# Altium schematic sheet 2 - BLE.SchDoc
size Tabloid
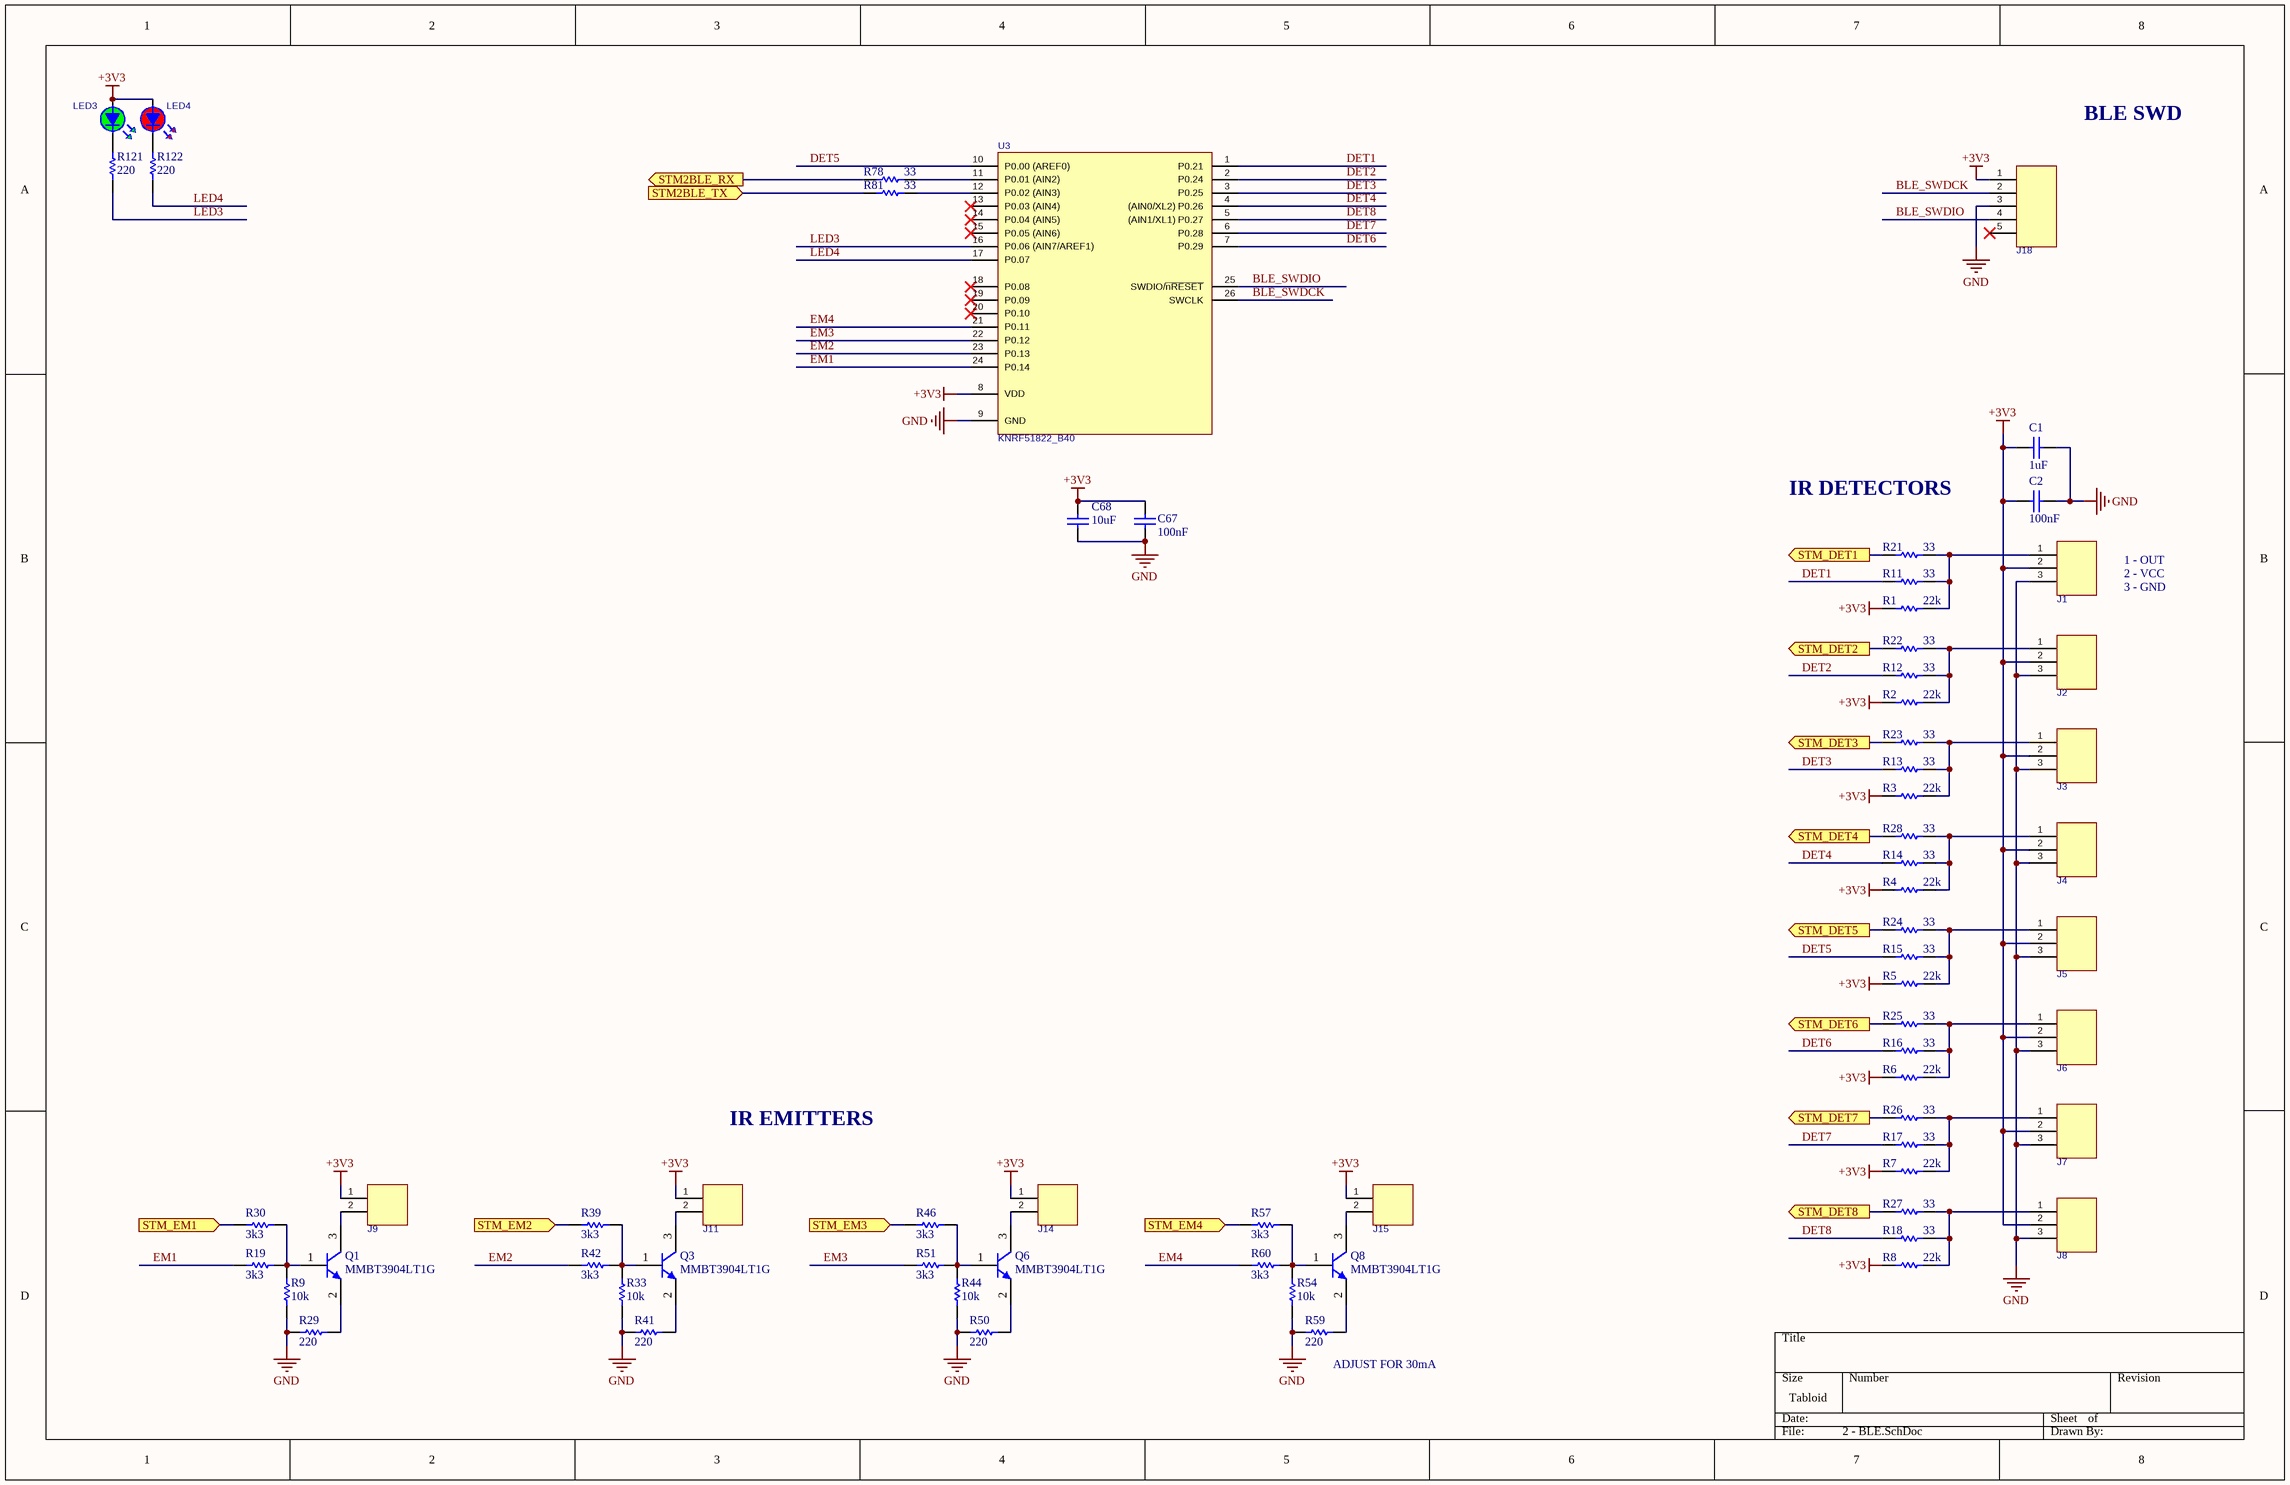
[diagram p0: 2 - BLE.SchDoc]

## Parts
C1  value 1uF  [CAPC0805(2012)100_L]  (hidden comment: CAP 1uF 6.3V 0805(2012))
C2  value 100nF  [CAPC0805(2012)100_L]  (hidden comment: CAP 100nF 6.3V 0805(2012))
C67  value 100nF  [CAPC0805(2012)100_N]  (hidden comment: CAP 100nF 6.3V 0805(2012))
C68  value 10uF  [CAPC0805(2012)100_N]  (hidden comment: CAP 10uF 6.3V 0805(2012))
J1  DF13-3P-1.25DS(20)  [HRS_DF13-3P-1.25DS(20)]  (value not drawn)
J2  DF13-3P-1.25DS(20)  [HRS_DF13-3P-1.25DS(20)]  (value not drawn)
J3  DF13-3P-1.25DS(20)  [HRS_DF13-3P-1.25DS(20)]  (value not drawn)
J4  DF13-3P-1.25DS(20)  [HRS_DF13-3P-1.25DS(20)]  (value not drawn)
J5  DF13-3P-1.25DS(20)  [HRS_DF13-3P-1.25DS(20)]  (value not drawn)
J6  DF13-3P-1.25DS(20)  [HRS_DF13-3P-1.25DS(20)]  (value not drawn)
J7  DF13-3P-1.25DS(20)  [HRS_DF13-3P-1.25DS(20)]  (value not drawn)
J8  DF13-3P-1.25DS(20)  [HRS_DF13-3P-1.25DS(20)]  (value not drawn)
J9  DF13-2P-1.25DS(20)  [HRS_DF13-2P-1.25DS(20)]  (value not drawn)
J11  DF13-2P-1.25DS(20)  [HRS_DF13-2P-1.25DS(20)]  (value not drawn)
J14  DF13-2P-1.25DS(20)  [HRS_DF13-2P-1.25DS(20)]  (value not drawn)
J15  DF13-2P-1.25DS(20)  [HRS_DF13-2P-1.25DS(20)]  (value not drawn)
J18  DF13-5P-1.25DS(20)  [HRS_DF13-5P-1.25DS(20)]  (value not drawn)
LED3  VLMG1500-GS08  [LEDC0402(1005)_N-GRN]  (value not drawn)
LED4  VLMS1500-GS08  [LEDC0402(1005)_N-RED]  (value not drawn)
Q1  MMBT3904LT1G  [ONSC-SOT-23-3-318-08_V]
Q3  MMBT3904LT1G  [ONSC-SOT-23-3-318-08_V]
Q6  MMBT3904LT1G  [ONSC-SOT-23-3-318-08_V]
Q8  MMBT3904LT1G  [ONSC-SOT-23-3-318-08_V]
R1  value 22k  [RESC0805(2012)_L]  (hidden comment: 22K 1% 0805(2012))
R2  value 22k  [RESC0805(2012)_L]  (hidden comment: 22K 1% 0805(2012))
R3  value 22k  [RESC0805(2012)_L]  (hidden comment: 22K 1% 0805(2012))
R4  value 22k  [RESC0805(2012)_L]  (hidden comment: 22K 1% 0805(2012))
R5  value 22k  [RESC0805(2012)_L]  (hidden comment: 22K 1% 0805(2012))
R6  value 22k  [RESC0805(2012)_L]  (hidden comment: 22K 1% 0805(2012))
R7  value 22k  [RESC0805(2012)_L]  (hidden comment: 22K 1% 0805(2012))
R8  value 22k  [RESC0805(2012)_L]  (hidden comment: 22K 1% 0805(2012))
R9  value 10k  [RESC0805(2012)_L]  (hidden comment: 10K 1% 0805(2012))
R11  value 33  [RESC0805(2012)_L]
R12  value 33  [RESC0805(2012)_L]
R13  value 33  [RESC0805(2012)_L]
R14  value 33  [RESC0805(2012)_L]
R15  value 33  [RESC0805(2012)_L]
R16  value 33  [RESC0805(2012)_L]
R17  value 33  [RESC0805(2012)_L]
R18  value 33  [RESC0805(2012)_L]
R19  value 3k3  [RESC0805(2012)_L]  (hidden comment: 3K3 1% 0805(2012))
R21  value 33  [RESC0805(2012)_L]
R22  value 33  [RESC0805(2012)_L]
R23  value 33  [RESC0805(2012)_L]
R24  value 33  [RESC0805(2012)_L]
R25  value 33  [RESC0805(2012)_L]
R26  value 33  [RESC0805(2012)_L]
R27  value 33  [RESC0805(2012)_L]
R28  value 33  [RESC0805(2012)_L]
R29  value 220  [RESC0805(2012)_L]  (hidden comment: 220R 1% 0805(2012))
R30  value 3k3  [RESC0805(2012)_L]  (hidden comment: 3K3 1% 0805(2012))
R33  value 10k  [RESC0805(2012)_L]  (hidden comment: 10K 1% 0805(2012))
R39  value 3k3  [RESC0805(2012)_L]  (hidden comment: 3K3 1% 0805(2012))
R41  value 220  [RESC0805(2012)_L]  (hidden comment: 220R 1% 0805(2012))
R42  value 3k3  [RESC0805(2012)_L]  (hidden comment: 3K3 1% 0805(2012))
R44  value 10k  [RESC0805(2012)_L]  (hidden comment: 10K 1% 0805(2012))
R46  value 3k3  [RESC0805(2012)_L]  (hidden comment: 3K3 1% 0805(2012))
R50  value 220  [RESC0805(2012)_L]  (hidden comment: 220R 1% 0805(2012))
R51  value 3k3  [RESC0805(2012)_L]  (hidden comment: 3K3 1% 0805(2012))
R54  value 10k  [RESC0805(2012)_L]  (hidden comment: 10K 1% 0805(2012))
R57  value 3k3  [RESC0805(2012)_L]  (hidden comment: 3K3 1% 0805(2012))
R59  value 220  [RESC0805(2012)_L]  (hidden comment: 220R 1% 0805(2012))
R60  value 3k3  [RESC0805(2012)_L]  (hidden comment: 3K3 1% 0805(2012))
R78  value 33  [RESC0805(2012)_L]
R81  value 33  [RESC0805(2012)_L]
R121  value 220  [RESC0805(2012)_L]
R122  value 220  [RESC0805(2012)_L]
U3  KNRF51822_B40  [MOD_KnRF51822_B40]

## Ports
STM2BLE_RX (out), STM2BLE_TX (in), STM_DET1 (out), STM_DET2 (out), STM_DET3 (out), STM_DET4 (out), STM_DET5 (out), STM_DET6 (out), STM_DET7 (out), STM_DET8 (out), STM_EM1 (in), STM_EM2 (in), STM_EM3 (in), STM_EM4 (in)

## Nets
+3V3: C1.1 C2.1 C67.1 C68.2 J1.2 J2.2 J3.2 J4.2 J5.2 J6.2 J7.2 J8.2 J9.1 J11.1 J14.1 J15.1 J18.1 LED3.A LED4.A R1.2 R2.2 R3.2 R4.2 R5.2 R6.2 R7.2 R8.2 U3.8(VDD)
GND: C1.2 C2.2 C67.2 C68.1 J1.3 J2.3 J3.3 J4.3 J5.3 J6.3 J7.3 J8.3 J18.3 R9.1 R29.2 R33.1 R41.2 R44.1 R50.2 R54.1 R59.2 U3.9(GND)
BLE_SWDCK: J18.2 U3.26(SWCLK)
BLE_SWDIO: J18.4 U3.25(SWDIO/~{nRESET})
DET1: R11.2 U3.1(P0.21)
DET2: R12.2 U3.2(P0.24)
DET3: R13.2 U3.3(P0.25)
DET4: R14.2 U3.4((AIN0/XL2)_P0.26)
DET5: R15.2 U3.10(P0.00_(AREF0))
DET6: R16.2 U3.7(P0.29)
DET7: R17.2 U3.6(P0.28)
DET8: R18.2 U3.5((AIN1/XL1)_P0.27)
EM1: R19.1 U3.24(P0.14)
EM2: R42.1 U3.23(P0.13)
EM3: R51.1 U3.22(P0.12)
EM4: R60.1 U3.21(P0.11)
LED3: R121.2 U3.16(P0.06_(AIN7/AREF1))
LED4: R122.2 U3.17(P0.07)
STM2BLE_RX: R78.2 ; port STM2BLE_RX
STM2BLE_TX: R81.2 ; port STM2BLE_TX
STM_DET1: R21.2 ; port STM_DET1
STM_DET2: R22.2 ; port STM_DET2
STM_DET3: R23.2 ; port STM_DET3
STM_DET4: R28.2 ; port STM_DET4
STM_DET5: R24.2 ; port STM_DET5
STM_DET6: R25.2 ; port STM_DET6
STM_DET7: R26.2 ; port STM_DET7
STM_DET8: R27.2 ; port STM_DET8
STM_EM1: R30.1 ; port STM_EM1
STM_EM2: R39.1 ; port STM_EM2
STM_EM3: R46.1 ; port STM_EM3
STM_EM4: R57.1 ; port STM_EM4
NetJ1_1: J1.1 R1.1 R11.1 R21.1
NetJ2_1: J2.1 R2.1 R12.1 R22.1
NetJ3_1: J3.1 R3.1 R13.1 R23.1
NetJ4_1: J4.1 R4.1 R14.1 R28.1
NetJ5_1: J5.1 R5.1 R15.1 R24.1
NetJ6_1: J6.1 R6.1 R16.1 R25.1
NetJ7_1: J7.1 R7.1 R17.1 R26.1
NetJ8_1: J8.1 R8.1 R18.1 R27.1
NetJ9_2: J9.2 Q1.3(C)
NetJ11_2: J11.2 Q3.3(C)
NetJ14_2: J14.2 Q6.3(C)
NetJ15_2: J15.2 Q8.3(C)
NetLED3_K: LED3.K R121.1
NetLED4_K: LED4.K R122.1
NetQ1_1: Q1.1(B) R9.2 R19.2 R30.2
NetQ1_2: Q1.2(E) R29.1
NetQ3_1: Q3.1(B) R33.2 R39.2 R42.2
NetQ3_2: Q3.2(E) R41.1
NetQ6_1: Q6.1(B) R44.2 R46.2 R51.2
NetQ6_2: Q6.2(E) R50.1
NetQ8_1: Q8.1(B) R54.2 R57.2 R60.2
NetQ8_2: Q8.2(E) R59.1
NetR78_1: R78.1 U3.11(P0.01_(AIN2))
NetR81_1: R81.1 U3.12(P0.02_(AIN3))

Not connected (* = marked no-connect by the designer): J18 5*; U3 13(P0.03_(AIN4))* 14(P0.04_(AIN5))* 15(P0.05_(AIN6))* 18(P0.08)* 19(P0.09)* 20(P0.10)*

## Notes on the sheet
- BLE SWD
- IR DETECTORS
- 1 - OUT
- 2 - VCC
- 3 - GND
- IR EMITTERS
- (near R59) ADJUST FOR 30mA

## Library data of the parts
C1 = CMP-1036-04730-1: CAP 1uF 6.3V Â±5% 0805 (2012 Metric) Thickness 1mm SMD; Case-Metric: 2012; Case-EIA: 0805; Technology: SMT; Tolerance: Â±5%; Max Thickness: 1 mm; Rated Voltage: 6.3 V
C2 C67 = CMP-1036-04391-1: CAP 100nF 6.3V Â±10% 0805 (2012 Metric) Thickness 1mm SMD; Case-EIA: 0805; Case-Metric: 2012; Rated Voltage: 6.3 V; Technology: SMT; Tolerance: Â±10%; Max Thickness: 1 mm
C68 = CMP-1036-04920-1: CAP 10uF 6.3V Â±20% 0805 (2012 Metric) Thickness 1mm SMD; Case-Metric: 2012; Case-EIA: 0805; Max Thickness: 1 mm; Tolerance: Â±20%; Rated Voltage: 6.3 V; Technology: SMT
J1-J8 = CON_HRS_DF13-3P-1.25DS(20): CONN HEADER 3POS 1.25MM R/A THT TIN; Manufacturer: Hirose Electric Co Ltd; Connector Type: Header, Shrouded; Number of Positions: 3; Number of Positions Loaded: All; Pitch: 0.049" (1.25mm); Manufacturer Part Number: DF13-3P-1.25DS(20); RoHS: RoHS Compliant; Category: Connectors, Interconnects; Packaging: Tube; Contact Type: Male Pin; Number of Rows: 1; Row Spacing: -; Contact Mating Length: -; Mounting Type: Through Hole, Right Angle; Termination: Solder; Fastening Type: -; Features: Board Guide; Contact Finish: Tin; Contact Finish Thickness: -; Color: Beige; ComponentLink1URL: http://www.hirose.co.jp/cataloge_hp/2d/EDC3-081817-01.pdf; ComponentLink1Description: http://www.hirose.co.jp/cataloge_hp/2d/EDC3-081817-01.pdf
J9 J11 J14 J15 = CON_HRS_DF13-2P-1.25DS(20): CONN HEADER 2POS 1.25MM R/A THT TIN; Manufacturer: Hirose Electric Co Ltd; Connector Type: Header, Shrouded; Number of Positions: 2; Number of Positions Loaded: All; Pitch: 0.049" (1.25mm); Manufacturer Part Number: DF13-2P-1.25DS(20); RoHS: RoHS Compliant; Category: Connectors, Interconnects; Packaging: Tube; Contact Type: Male Pin; Number of Rows: 1; Row Spacing: -; Contact Mating Length: -; Mounting Type: Through Hole, Right Angle; Termination: Solder; Fastening Type: -; Features: Board Guide; Contact Finish: Tin; Contact Finish Thickness: -; Color: Beige; ComponentLink1URL: http://www.hirose.co.jp/cataloge_hp/2d/EDC3-081817-01.pdf; ComponentLink1Description: http://www.hirose.co.jp/cataloge_hp/2d/EDC3-081817-01.pdf
J18 = CON_HRS_DF13-5P-1.25DS(20): CONN HEADER 5POS 1.25MM R/A THT TIN; Manufacturer: Hirose Electric Co Ltd; Connector Type: Header, Shrouded; Number of Positions: 5; Number of Positions Loaded: All; Pitch: 0.049" (1.25mm); Supplier 1: Digi-Key; Manufacturer Part Number: DF13-5P-1.25DS(20); RoHS: RoHS Compliant; Category: Connectors, Interconnects; Stock 1: 10851; Pricing 1: 1=0.61, 10=0.57, 50=0.456, 100=0.437, 250=0.399, 500=0.38, 1000=0.3135, 2500=0.285, 5000=0.2755 (USD); Packaging: Tube; Contact Type: Male Pin; Number of Rows: 1; Row Spacing: -; Contact Mating Length: -; Mounting Type: Through Hole, Right Angle; Termination: Solder; Fastening Type: -; Features: Board Guide; Contact Finish: Tin; Contact Finish Thickness: -; Color: Beige; ComponentLink1URL: http://www.hirose.co.jp/cataloge_hp/2d/EDC3-081818-01.pdf; ComponentLink1Description: http://www.hirose.co.jp/cataloge_hp/2d/EDC3-081818-01.pdf; Supplier Part Number 1: H2202-ND
LED3 = LED_0402_VLMG1500-GS08: LED GREEN 0402 SMD; Manufacturer: Vishay Semiconductor Opto Division; Wavelength - Dominant: 571nm; Wavelength - Peak: 574nm; Millicandela Rating: 35mcd; Voltage - Forward (Vf) (Typ): 2V; Current - Test: 20mA; Viewing Angle: 130°; Lens Style/Size: Rectangle with Flat Top, 1.00mm x 0.50mm; Supplier 1: Digi-Key; Manufacturer Part Number: VLMG1500-GS08; RoHS: RoHS Compliant; Category: Optoelectronics; Stock 1: 37065; Pricing 1: 1=0.52, 10=0.384, 25=0.3072, 100=0.2035, 250=0.144, 500=0.12288, 750=0.10368, 1000=0.096 (USD); Packaging: Cut Tape (CT); Color: Green; Lens Transparency: -; Lens Color: -; Package / Case: 0402 (1005 Metric); Supplier Device Package: 0402; Size / Dimension: 1.00mm L x 0.50mm W; Height (Max): 0.35mm; Mounting Type: Surface Mount; ComponentLink1URL: http://www.vishay.com/docs/82554/vlmo1500.pdf; ComponentLink1Description: http://www.vishay.com/docs/82554/vlmo1500.pdf; Supplier Part Number 1: VLMG1500-GS08CT-ND
LED4 = LED_0402_VLMS1500-GS08: LED RED 0402 SMD; Manufacturer: Vishay Semiconductor Opto Division; Wavelength - Dominant: 631nm; Wavelength - Peak: 639nm; Millicandela Rating: 54mcd; Voltage - Forward (Vf) (Typ): 2V; Current - Test: 20mA; Viewing Angle: 130°; Lens Style/Size: Rectangle with Flat Top, 1.00mm x 0.50mm; Supplier 1: Digi-Key; Manufacturer Part Number: VLMS1500-GS08; RoHS: RoHS Compliant; Category: Optoelectronics; Stock 1: 41406; Pricing 1: 1=0.52, 10=0.384, 25=0.3072, 100=0.2035, 250=0.144, 500=0.12288, 750=0.10368, 1000=0.096 (USD); Packaging: Cut Tape (CT); Color: Red; Lens Transparency: -; Lens Color: -; Package / Case: 0402 (1005 Metric); Supplier Device Package: 0402; Size / Dimension: 1.00mm L x 0.50mm W; Height (Max): 0.35mm; Mounting Type: Surface Mount; ComponentLink1URL: http://www.vishay.com/docs/82554/vlmo1500.pdf; ComponentLink1Description: http://www.vishay.com/docs/82554/vlmo1500.pdf; Supplier Part Number 1: VLMS1500-GS08CT-ND
Q1 Q3 Q6 Q8 = CMP-1048-00631-1: General Purpose Transistor, NPN Silicon, 3-Pin SOT-23, Pb-Free, Tape and Reel; Manufacturer: On Semiconductor; IC Continuous (A): 0.2; fT Min (MHz): 300; ComponentLink2Description: Datasheet; Polarity: NPN; PackageDescription: 3-Pin Small Outline Transistor, Body 2.92 x 1.3 mm, Pitch 0.95 mm; ComponentLink2URL: http://www.onsemi.cn/pub_link/Collateral/MMBT3904LT1-D.PDF; DatasheetVersion: Rev. 12; Mounting Technology: Surface Mount; PartNumber: MMBT3904LT1G; ComponentLink1URL: http://www.onsemi.com/; ComponentLink3Description: Package Specification; ComponentLink1Description: Manufacturer URL; PackageVersion: Rev. AP, 11/2009; PackageReference: SOT-23-3-318-08; Packing: Tape and Reel; ComponentLink3URL: http://www.onsemi.cn/pub_link/Collateral/318-08.PDF; RoHS: TRUE
R1-R8 = CMP-1013-00659-1: 22K 0.125W 1% 0805 (2012 Metric)  SMD; Case-EIA: 0805; Case-Metric: 2012; Tolerance: 1 %; Technology: SMT; Power: 0.125 W
R9 R11-R18 R21-R28 R33 R44 R54 R78 R81 = CMP-1013-00623-1: 10K 0.125W 1% 0805 (2012 Metric)  SMD; Case-Metric: 2012; Case-EIA: 0805; Tolerance: 1 %; Power: 0.125 W; Technology: SMT
R19 R30 R39 R42 R46 R51 R57 R60 = CMP-1013-00567-1: 3K3 0.125W 1% 0805 (2012 Metric)  SMD; Case-Metric: 2012; Case-EIA: 0805; Technology: SMT; Tolerance: 1 %; Power: 0.125 W
R29 R41 R50 R59 = CMP-1013-00433-1: 220R 0.125W 1% 0805 (2012 Metric)  SMD; Case-EIA: 0805; Case-Metric: 2012; Technology: SMT; Tolerance: 1 %; Power: 0.125 W
R121 R122 = CMP-1013-00623-1: 220R 0.125W 1% 0805 (2012 Metric)  SMD; Case-Metric: 2012; Case-EIA: 0805; Tolerance: 1 %; Power: 0.125 W; Technology: SMT
U3 = RF_KNRF51822_B40: BLE / MULTI-PROTOCOL 2.4GHz RF MODULE; Manufacturer: NST; Supply Voltage: 1.8 - 3.6V; Current consumption: 11.8mA typ; PCB Size: 13.5mm x 16.2mm; Frequency range: 2400 – 2483.5 MHz; Tx power: 4 dBm; Rx sensitivity: -93 dBm typ.; Antenna: PCB Antenna; Core IC: Nordic nRF51822; Manufacturer Part Number: KNRF51822_B40; Operating temperature: -25 to +75°C